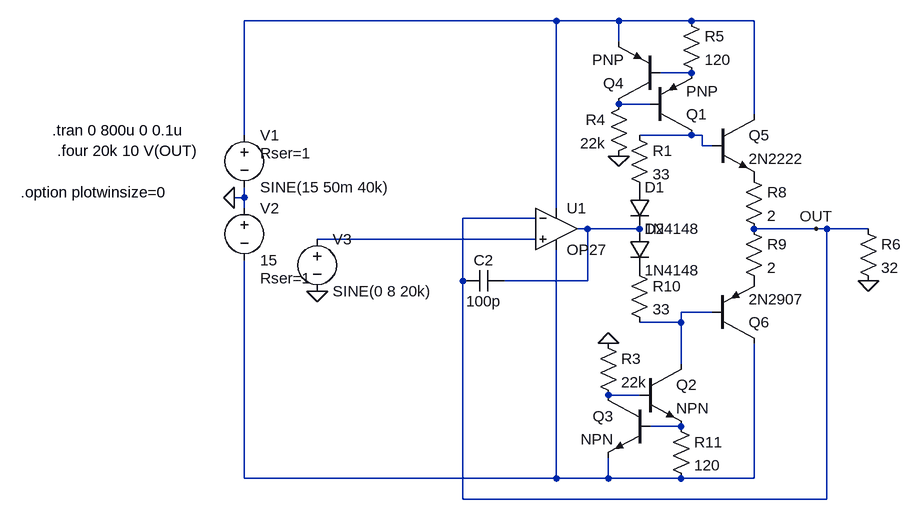
[diagram p0: schematic opamp_amplifier_self.asc]
opamp_amplifier_self.asc, the LTspice schematic file:
Version 4
SHEET 1 1568 680
WIRE 416 -272 -64 -272
WIRE 512 -272 416 -272
WIRE 624 -272 512 -272
WIRE 720 -272 624 -272
WIRE 512 -240 512 -272
WIRE 624 -192 576 -192
WIRE 560 -144 512 -144
WIRE 720 -128 720 -272
WIRE -64 -96 -64 -272
WIRE 624 -96 544 -96
WIRE 640 -96 624 -96
WIRE 640 -80 640 -96
WIRE 656 -80 640 -80
WIRE -64 0 -64 -16
WIRE -64 0 -80 0
WIRE -64 16 -64 0
WIRE 416 16 416 -272
WIRE 384 32 272 32
WIRE 464 48 448 48
WIRE 544 48 464 48
WIRE 816 48 720 48
WIRE 832 48 816 48
WIRE 896 48 832 48
WIRE 384 64 48 64
WIRE 272 128 272 32
WIRE 464 128 464 48
WIRE 464 128 336 128
WIRE 656 176 608 176
WIRE 608 192 608 176
WIRE 608 192 544 192
WIRE 608 256 608 192
WIRE 544 304 496 304
WIRE 608 352 560 352
WIRE -64 432 -64 96
WIRE 416 432 416 80
WIRE 416 432 -64 432
WIRE 496 432 496 400
WIRE 496 432 416 432
WIRE 608 432 496 432
WIRE 720 432 720 224
WIRE 720 432 608 432
WIRE 272 464 272 128
WIRE 832 464 832 48
WIRE 832 464 272 464
FLAG -80 0 0
FLAG 48 144 0
FLAG 816 48 OUT
FLAG 896 128 0
FLAG 496 224 0
FLAG 512 -64 0
SYMBOL voltage -64 -112 R0
WINDOW 123 0 0 Left 0
WINDOW 39 24 44 Left 2
SYMATTR SpiceLine Rser=1
SYMATTR InstName V1
SYMATTR Value SINE(15 50m 40k)
SYMBOL voltage -64 0 R0
WINDOW 123 0 0 Left 0
WINDOW 39 24 124 Left 2
SYMATTR SpiceLine Rser=1
SYMATTR InstName V2
SYMATTR Value 15
SYMBOL voltage 48 48 R0
WINDOW 123 24 124 Left 2
WINDOW 39 0 0 Left 0
SYMATTR InstName V3
SYMATTR Value SINE(0 8 20k)
SYMBOL npn 656 -128 R0
SYMATTR InstName Q5
SYMATTR Value 2N2222
SYMBOL pnp 656 224 M180
SYMATTR InstName Q6
SYMATTR Value 2N2907
SYMBOL res 704 -48 R0
SYMATTR InstName R8
SYMATTR Value 2
SYMBOL res 704 32 R0
SYMATTR InstName R9
SYMATTR Value 2
SYMBOL cap 272 112 M90
WINDOW 0 0 32 VBottom 2
WINDOW 3 32 32 VTop 2
SYMATTR InstName C2
SYMATTR Value 100p
SYMBOL res 880 32 R0
SYMATTR InstName R6
SYMATTR Value 32
SYMBOL OpAmps\\OP27 416 -16 R0
SYMATTR InstName U1
SYMBOL npn 544 256 R0
SYMATTR InstName Q2
SYMBOL npn 560 304 M0
SYMATTR InstName Q3
SYMBOL res 480 208 R0
SYMATTR InstName R3
SYMATTR Value 22k
SYMBOL res 592 336 R0
SYMATTR InstName R11
SYMATTR Value 120
SYMBOL diode 528 -16 R0
SYMATTR InstName D1
SYMATTR Value 1N4148
SYMBOL diode 528 48 R0
SYMATTR InstName D2
SYMATTR Value 1N4148
SYMBOL pnp 560 -96 M180
SYMATTR InstName Q1
SYMBOL pnp 576 -144 R180
SYMATTR InstName Q4
SYMBOL res 528 -160 M0
SYMATTR InstName R4
SYMATTR Value 22k
SYMBOL res 608 -288 R0
SYMATTR InstName R5
SYMATTR Value 120
SYMBOL res 528 -112 R0
SYMATTR InstName R1
SYMATTR Value 33
SYMBOL res 528 96 R0
SYMATTR InstName R10
SYMATTR Value 33
TEXT -360 -104 Left 2 !.tran 0 800u 0 0.1u
TEXT -352 -72 Left 2 !.four 20k 10 V(OUT)
TEXT -408 -8 Left 2 !.option plotwinsize=0

The netlist it stands for:
* opamp_amplifier_self.asc
V1 N001 0 SINE(15 50m 40k) Rser=1
V2 0 N010 15 Rser=1
V3 N006 0 SINE(0 8 20k)
Q5 N001 N004 P001 0 2N2222
Q6 N010 N007 P002 0 2N2907
R8 P001 OUT 2
R9 OUT P002 2
C2 OUT N005 100p
R6 OUT 0 32
XU1 N006 OUT N001 N010 N005 OP27  ; pins In+ In- V+ V- OUT
Q2 N007 N008 N009 0 NPN
Q3 N008 N009 N010 0 NPN
R3 0 N008 22k
R11 N009 N010 120
D1 P003 N005 1N4148
D2 N005 P004 1N4148
Q1 N004 N003 N002 0 PNP
Q4 N003 N002 N001 0 PNP
R4 N003 0 22k
R5 N001 N002 120
R1 N004 P003 33
R10 P004 N007 33
.model D D
.lib standard.dio
.model NPN NPN
.model PNP PNP
.lib standard.bjt
.tran 0 800u 0 0.1u
.four 20k 10 V(OUT)
.option plotwinsize=0
.lib ADI.lib
.backanno
.end